# Altium schematic sheet [04] Input.SchDoc
size A
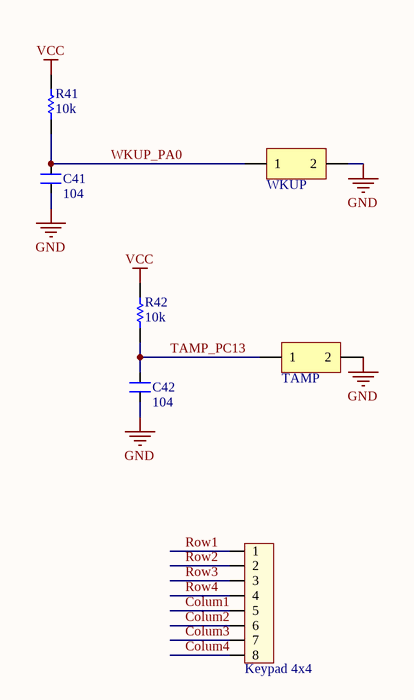
[diagram p0: [04] Input.SchDoc]

## Parts
C41  value 104  [CAPC1608N]  (hidden comment: CAP NP)
C42  value 104  [CAPC1608N]  (hidden comment: CAP NP)
Keypad_4x4  JP8  [CON8]  (value not drawn)
R41  value 10k  [RESC1608N_ZERO]  (hidden comment: Res)
R42  value 10k  [RESC1608N_ZERO]  (hidden comment: Res)
TAMP  Button  [SW]  (value not drawn)
WKUP  Button  [SW]  (value not drawn)

## Nets
GND: C41.1 C42.1 TAMP.2 WKUP.2
VCC: R41.2 R42.2
Colum1: Keypad_4x4.5
Colum2: Keypad_4x4.6
Colum3: Keypad_4x4.7
Colum4: Keypad_4x4.8
Row1: Keypad_4x4.1
Row2: Keypad_4x4.2
Row3: Keypad_4x4.3
Row4: Keypad_4x4.4
TAMP_PC13: C42.2 R42.1 TAMP.1
WKUP_PA0: C41.2 R41.1 WKUP.1

## Library data of the parts
Keypad_4x4 = Con8: Connector 8; Value: Connector 8
TAMP WKUP = Button I